# Altium schematic sheet Deneigus_BMS.SchDoc
size Tabloid; Date: Date; Author: Author 1; Revision: 1; Size: 11x17; Sheet_Name: BMS
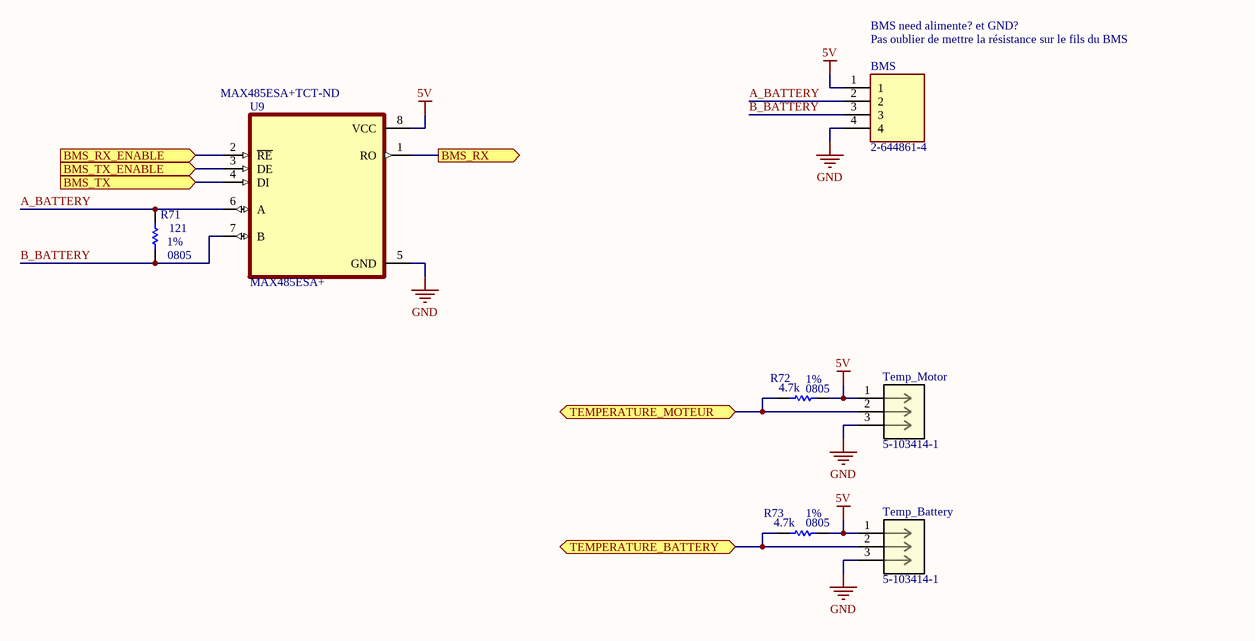
[diagram p0: Deneigus_BMS.SchDoc]

## Parts
BMS  2-644861-4  [TE_2-644861-4]
R71  value 121  Package: 0805  Precision: 1%  [RES_0805]  (hidden comment: RES - 0805)
R72  value 4.7k  Package: 0805  Precision: 1%  [RES_0805]  (hidden comment: RES - 0805)
R73  value 4.7k  Package: 0805  Precision: 1%  [RES_0805]  (hidden comment: RES - 0805)
Temp_Battery  5-103414-1  [CONN_5-103414-1_TYCO]
Temp_Motor  5-103414-1  [CONN_5-103414-1_TYCO]
U9  MAX485ESA+  Supplier Part Number 1: MAX485ESA+TCT-ND  [SOIC127P600X175-8N]

## Ports
BMS_RX (out), BMS_RX_ENABLE (in), BMS_TX (in), BMS_TX_ENABLE (in), TEMPERATURE_BATTERY (bidir), TEMPERATURE_MOTEUR (bidir)

## Nets
5V: BMS.1 R72.2 R73.2 Temp_Battery.1 Temp_Motor.1 U9.8(VCC)
GND: BMS.4 Temp_Battery.3 Temp_Motor.3 U9.5(GND)
A_BATTERY: BMS.2 R71.2 U9.6(A)
B_BATTERY: BMS.3 R71.1 U9.7(B)
BMS_RX: U9.1(RO) ; port BMS_RX
BMS_RX_ENABLE: U9.2(~{RE}) ; port BMS_RX_ENABLE
BMS_TX: U9.4(DI) ; port BMS_TX
BMS_TX_ENABLE: U9.3(DE) ; port BMS_TX_ENABLE
TEMPERATURE_BATTERY: R73.1 Temp_Battery.2 ; port TEMPERATURE_BATTERY
TEMPERATURE_MOTEUR: R72.1 Temp_Motor.2 ; port TEMPERATURE_MOTEUR

## Notes on the sheet
- BMS need alimente? et GND?
- (near BMS) Pas oublier de mettre la résistance sur le fils du BMS
- Sheet Name
- Project Title
- Global Project
- Revision
- Size
- Date
- Group
- Sheet
- of
- Filename
- Designers

## Library data of the parts
BMS = 2-644861-4: Connector Header Through Hole 4 position 0.100 (2.54mm); MF: TE Connectivity; Availability: Good; Value: *; Check_prices: https://www.snapeda.com/parts/2-644861-4/TE%20Connectivity%20AMP%20Connectors/view-part/2876279/?ref=eda; Package: None; Price: None; MP: 2-644861-4; SnapEDA_Link: https://www.snapeda.com/parts/2-644861-4/TE%20Connectivity%20AMP%20Connectors/view-part/2876279/?ref=snap; Purchase-URL: https://pricing.snapeda.com/search/part/2-644861-4/?ref=eda
Temp_Battery Temp_Motor = 5-103414-1: No Description Available; Vendor: TE Connectivity; Built_By: EMA_UL_Team; SourceLibrary: Tyco_2012-1-03; Manufacturer_Part_Number: 5-103414-1; Copyright: Copyright (C) 2016 Accelerated Designs. All rights reserved; RefDes: RefDes; Type: DEV; Supplier 1: Digikey; Supplier Part Number 1: A32977-ND
U9 = MAX485ESA+: 1/1 Transceiver Half RS422, RS485 8-SOIC; MF: Maxim Integrated; Availability: Unavailable; SnapEDA_Link: https://www.snapeda.com/parts/MAX485ESA%2B/Maxim%20Integrated/view-part/553653/?ref=snap; MP: MAX485ESA+; Value: *; Price: None; Package: SOIC-8 Maxim; Supplier 1: Digi-Key
R71-R73 = RES - 0805: Current: *; CreatedBy: Jonathan Bouchard